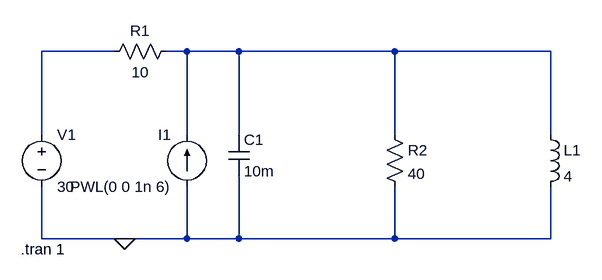
[diagram p0: schematic Q8_46.asc]
Q8_46.asc, the LTspice schematic file:
Version 4
SHEET 1 880 680
WIRE -48 144 -160 144
WIRE 64 144 32 144
WIRE 144 144 64 144
WIRE 384 144 144 144
WIRE 624 144 384 144
WIRE -160 272 -160 144
WIRE 64 272 64 144
WIRE 144 272 144 144
WIRE 384 272 384 144
WIRE 624 272 624 144
WIRE -160 432 -160 352
WIRE -32 432 -160 432
WIRE 64 432 64 352
WIRE 64 432 -32 432
WIRE 144 432 144 336
WIRE 144 432 64 432
WIRE 384 432 384 352
WIRE 384 432 144 432
WIRE 624 432 624 352
WIRE 624 432 384 432
FLAG -32 432 0
SYMBOL voltage -160 256 R0
WINDOW 123 0 0 Left 0
WINDOW 39 0 0 Left 0
SYMATTR InstName V1
SYMATTR Value 30
SYMBOL res 48 128 R90
WINDOW 0 0 56 VBottom 2
WINDOW 3 32 56 VTop 2
SYMATTR InstName R1
SYMATTR Value 10
SYMBOL cap 128 272 R0
SYMATTR InstName C1
SYMATTR Value 10m
SYMBOL res 368 256 R0
SYMATTR InstName R2
SYMATTR Value 40
SYMBOL ind 608 256 R0
SYMATTR InstName L1
SYMATTR Value 4
SYMBOL current 64 352 R180
WINDOW 0 24 80 Left 2
WINDOW 3 24 0 Left 2
WINDOW 123 0 0 Left 0
WINDOW 39 0 0 Left 0
SYMATTR InstName I1
SYMATTR Value PWL(0 0 1n 6)
TEXT -192 448 Left 2 !.tran 1

The netlist it stands for:
* Q8_46.asc
V1 N001 0 30
R1 N002 N001 10
C1 N002 0 10m
R2 N002 0 40
L1 N002 0 4
I1 0 N002 PWL(0 0 1n 6)
.tran 1
.backanno
.end